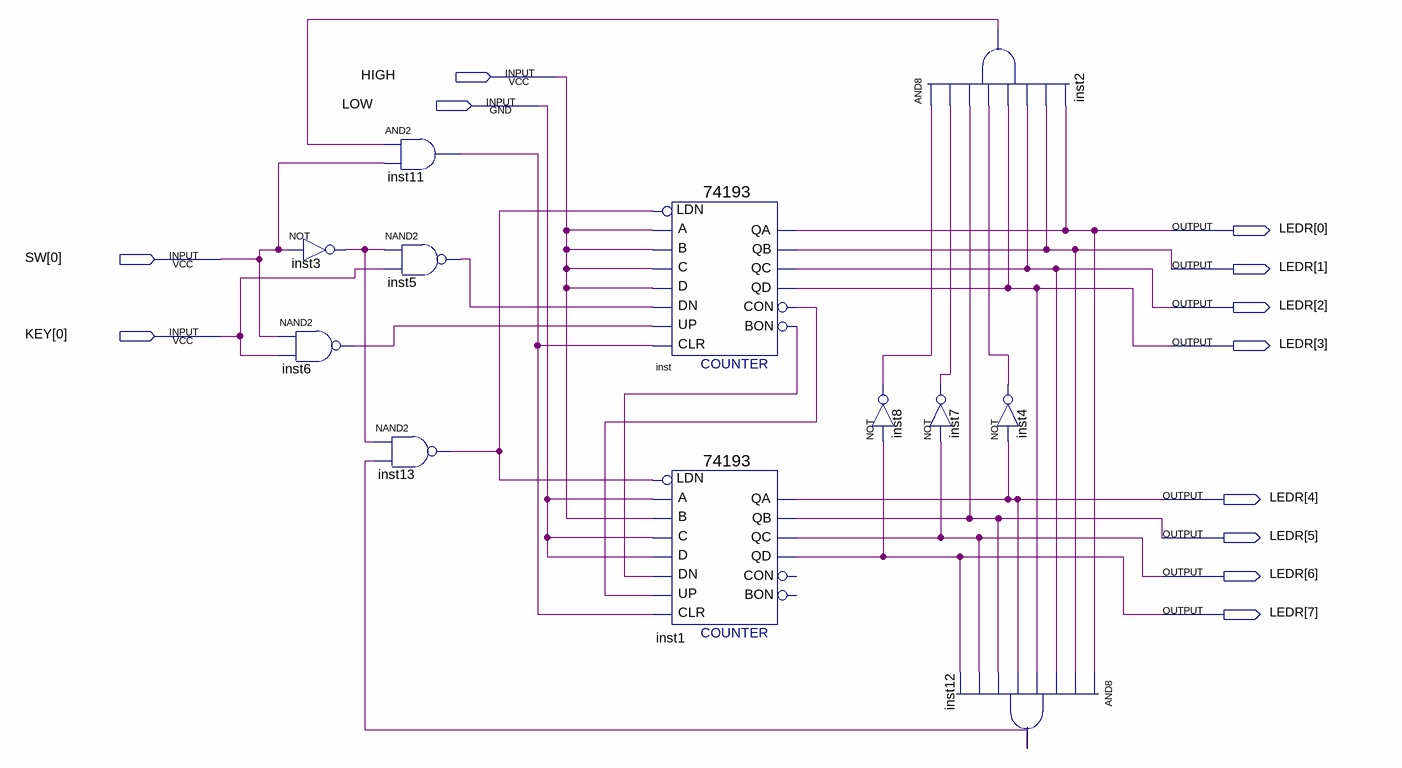
[diagram p0: schematic sheet]
// Quartus schematic lab34.bdf as structural Verilog: 12 symbols, 12 pins
module lab34 (
  input  HIGH,
  input  LOW,
  input  [0:0] SW,
  input  [0:0] KEY,
  output [7:0] LEDR
);

  wire inst2_out, inst3_out, inst4_out, inst5_out, inst6_out, inst7_out, inst8_out, inst11_out, inst12_out,
       inst13_out, inst_bon, inst_con;

  not inst3 (inst3_out, SW[0]);
  nand inst6 (inst6_out, SW[0], KEY[0]);
  nand inst13 (inst13_out, inst3_out, inst12_out);
  and inst11 (inst11_out, inst2_out, SW[0]);
  nand inst5 (inst5_out, inst3_out, KEY[0]);
  \74193  inst (
    .D(HIGH), .C(HIGH), .B(HIGH), .A(HIGH), .CLR(inst11_out), .UP(inst6_out), .DN(inst5_out),
    .LDN(inst13_out), .QB(LEDR[1]), .QA(LEDR[0]), .CON(inst_con), .QD(LEDR[3]), .QC(LEDR[2]), .BON(inst_bon));
  \74193  inst1 (
    .D(LOW), .C(LOW), .B(HIGH), .A(LOW), .CLR(inst11_out), .UP(inst_con), .DN(inst_bon), .LDN(inst13_out),
    .QB(LEDR[5]), .QA(LEDR[4]), .QD(LEDR[7]), .QC(LEDR[6]));  // open: CON, BON
  and inst2 (inst2_out, inst8_out, inst7_out, LEDR[5], inst4_out, LEDR[3], LEDR[2], LEDR[1], LEDR[0]);
  not inst8 (inst8_out, LEDR[7]);
  not inst7 (inst7_out, LEDR[6]);
  not inst4 (inst4_out, LEDR[4]);
  and inst12 (inst12_out, LEDR[0], LEDR[1], LEDR[2], LEDR[3], LEDR[4], LEDR[5], LEDR[6], LEDR[7]);
endmodule
